# Altium project my_final_project.PrjPcb
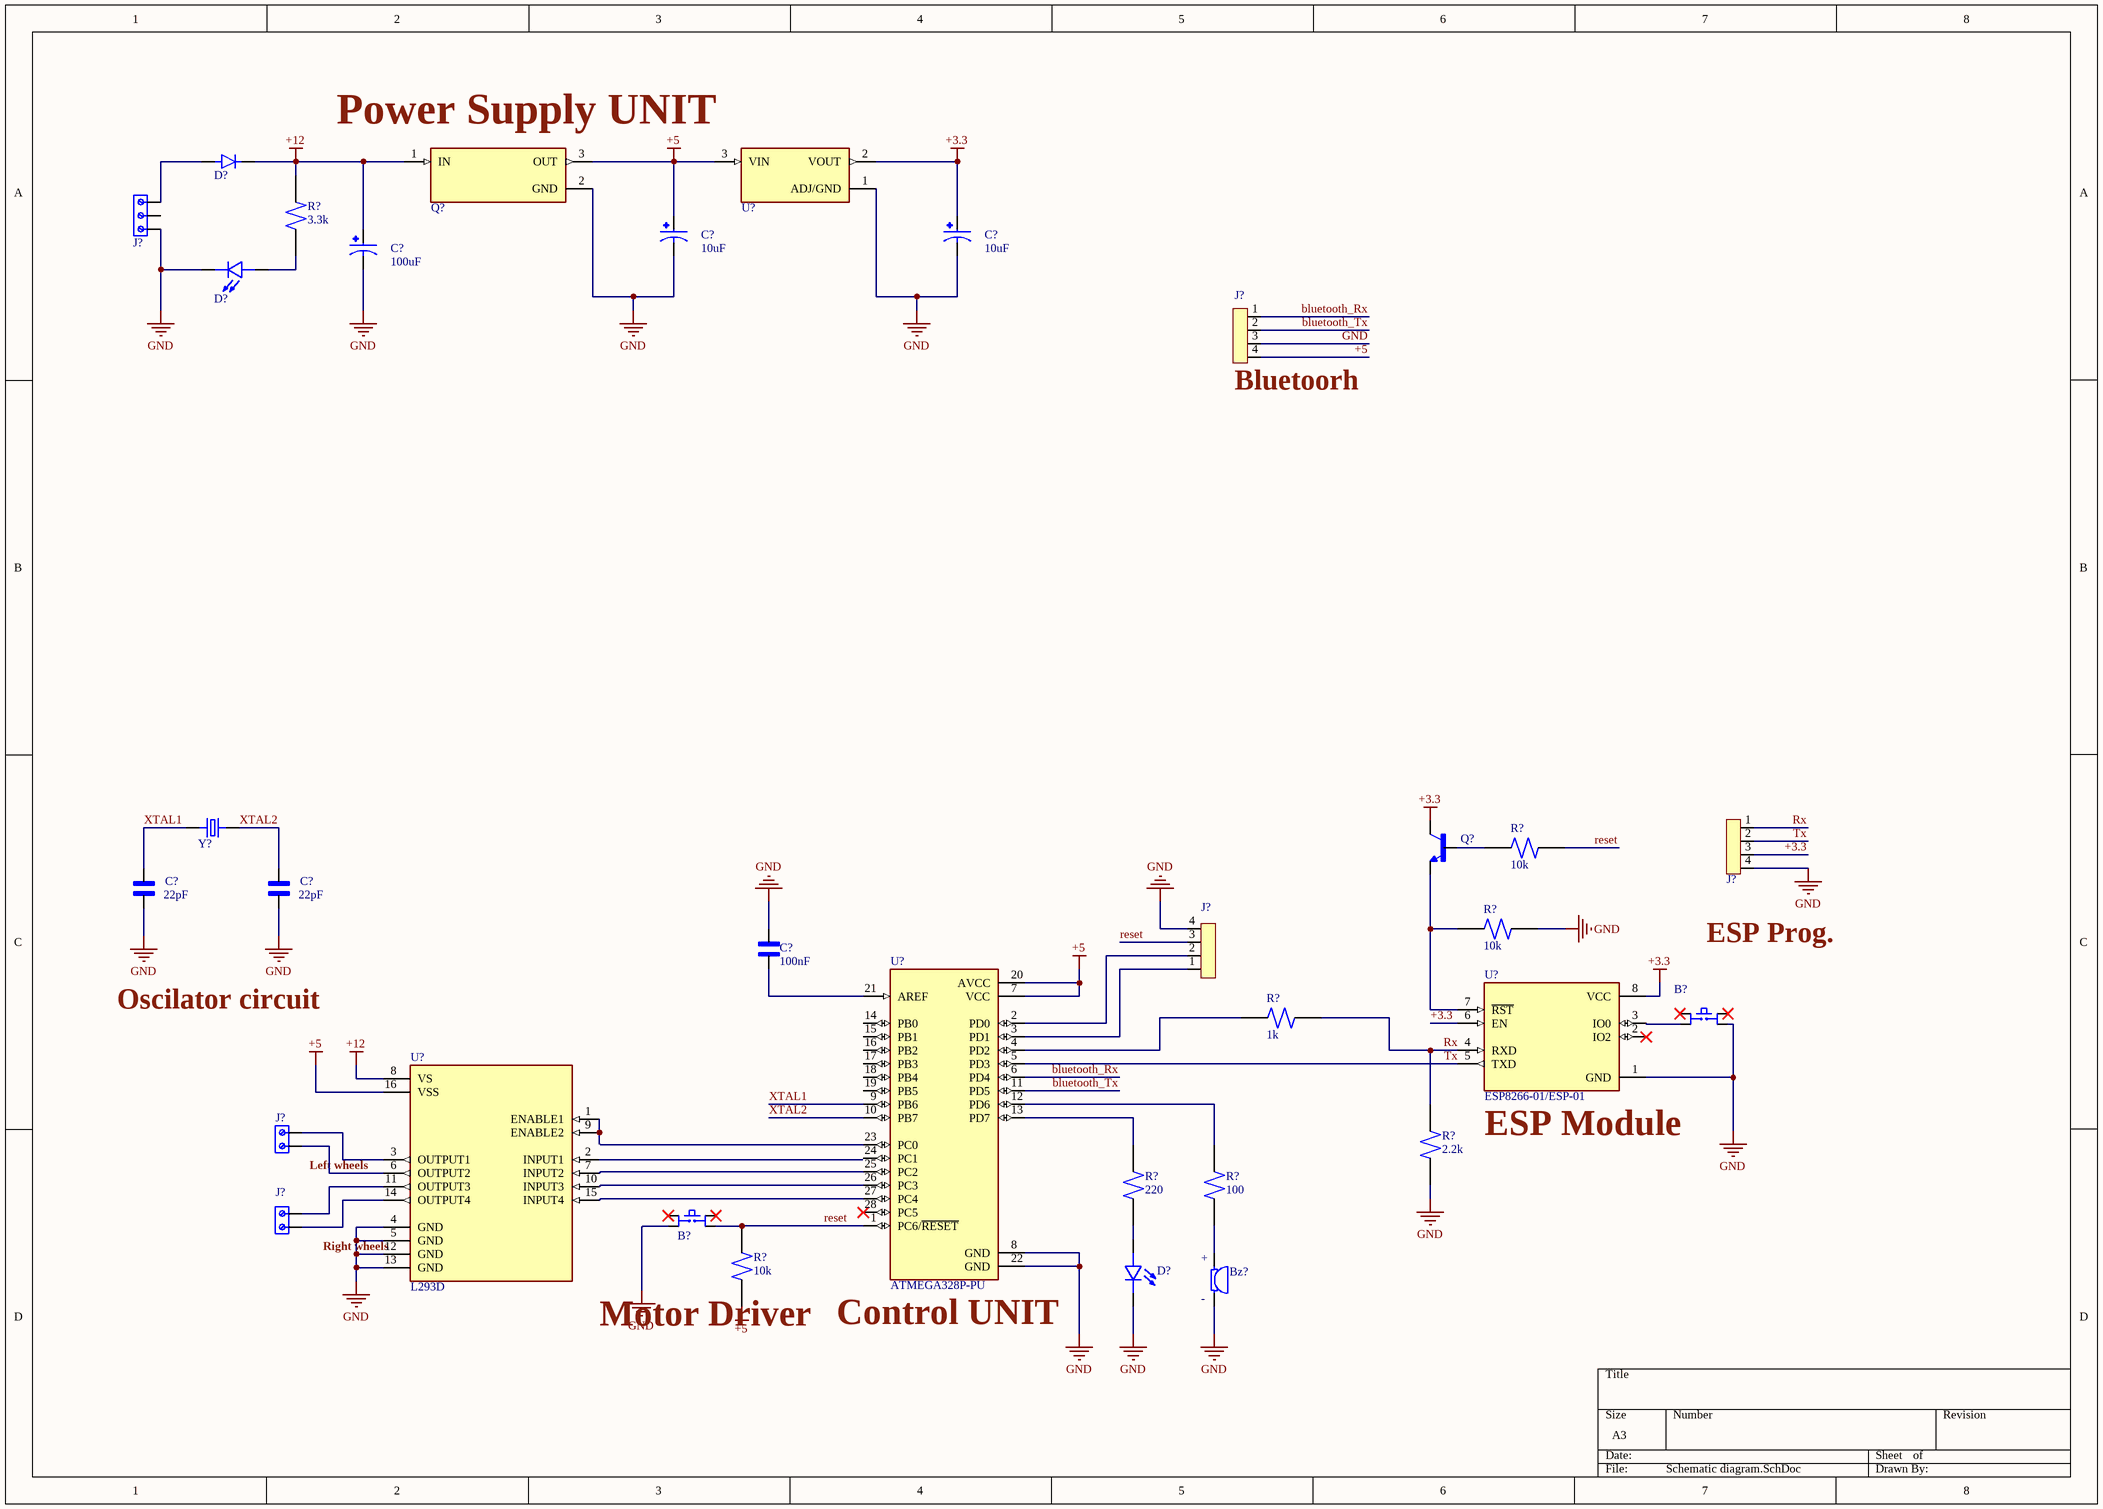
[diagram p0: Schematic diagram.SchDoc]
1 sheet, 33 parts. Net scope: global (net labels, ports and power ports of the same name join across sheets).

## Sheet Schematic diagram.SchDoc
size A3; SheetNumber: 1; SheetTotal: 1

### Parts
(Parts that share a designator on the sheet are numbered #1, #2 ... from top to bottom, then left to right.)
B?#1  Push button  [SW_TS02-66-95-BK-260-LCR-D]  (value not drawn)
B?#2  Push button  [SW_TS02-66-95-BK-260-LCR-D]  (value not drawn)
Bz?  AI-1223-TWT-12V-R  [XDCR_AI-1223-TWT-12V-R]  (value not drawn)
C?#1  10uF  [CAPPRD500W50D500H1100]
C?#2  10uF  [CAPPRD500W50D500H1100]
C?#3  100uF  [CAPPRD500W50D500H1100]
C?#4  22pF  [CAPRB500W50L450T300H550]
C?#5  22pF  [CAPRB500W50L450T300H550]
C?#6  100nF  [CAPRB500W50L450T300H550]
D?#1  1N4007  [DIOAD1060W70L435D230]  (value not drawn)
D?#2  L08R5000Q1  [LEDRD254W57D500H1070]  (value not drawn)
D?#3  L08R5000Q1  [LEDRD254W57D500H1070]  (value not drawn)
J?#1  691214110003  [691214110003]  (value not drawn)
J?#2  PPTC041LFBN-RC  [SULLINS_PPTC041LFBN-RC]  (value not drawn)
J?#3  PPTC041LFBN-RC  [SULLINS_PPTC041LFBN-RC]  (value not drawn)
J?#4  PPTC041LFBN-RC  [SULLINS_PPTC041LFBN-RC]  (value not drawn)
J?#5  691111710002  [691111710002]  (value not drawn)
J?#6  691111710002  [691111710002]  (value not drawn)
Q?#1  5V Regulator  [TO254P1054X470X1955-3]  (value not drawn)
Q?#2  BJT Transistor  [TO92250P510H770-3]  (value not drawn)
R?#1  3.3k  [RESAD1100W55L680D260]
R?#2  10k  [RESAD1100W55L680D260]
R?#3  10k  [RESAD1100W55L680D260]
R?#4  1k  [RESAD1100W55L680D260]
R?#5  2.2k  [RESAD1100W55L680D260]
R?#6  220  [RESAD1100W55L680D260]
R?#7  100  [RESAD1100W55L680D260]
R?#8  10k  [RESAD1100W55L680D260]
U?#1  3.3V Regulator  [TO255P1020X450X1968-3]  (value not drawn)
U?#2  ESP8266-01/ESP-01  [XCVR_ESP8266-01/ESP-01]
U?#3  ATMEGA328P-PU  [DIP794W46P254L2967H457Q28B]
U?#4  L293D  [DIP880W50P254L2000H510Q16]
Y?  ECS-160-S-4  [XTAL_ECS-160-20-4X]  (value not drawn)

### Nets
+3.3: C?#2.P J?#3.3 Q?#2.1(C) U?#1.2(VOUT) U?#2.6(EN) U?#2.8(VCC)
+5: C?#1.P J?#2.4 Q?#1.3(OUT) R?#8.1 U?#1.3(VIN) U?#3.7(VCC) U?#3.20(AVCC) U?#4.16(VSS)
+12: C?#3.P D?#1.C Q?#1.1(IN) R?#1.2 U?#4.8(VS)
GND: B?#1.4 B?#2.2 Bz?.N(NEG) C?#1.N C?#2.N C?#3.N C?#4.1 C?#5.1 C?#6.1 D?#2.C D?#3.C J?#1.1 J?#2.3 J?#3.4 J?#4.4 Q?#1.2(GND) R?#3.2 R?#5.1 U?#1.1(ADJ/GND) U?#2.1(GND) U?#3.8(GND) U?#3.22(GND) U?#4.4(GND) U?#4.5(GND) U?#4.12(GND) U?#4.13(GND)
bluetooth_Rx: J?#2.1 U?#3.6(PD4)
bluetooth_Tx: J?#2.2 U?#3.11(PD5)
reset: B?#2.4 J?#4.3 R?#2.2 R?#8.2 U?#3.1(PC6/~{RESET})
Rx: J?#3.1 R?#4.1 R?#5.2 U?#2.4(RXD)
Tx: J?#3.2 U?#2.5(TXD) U?#3.5(PD3)
XTAL1: C?#4.2 U?#3.9(PB6) Y?.1
XTAL2: C?#5.2 U?#3.10(PB7) Y?.2
NetB?#1_2: B?#1.2 U?#2.3(IO0)
NetBz?_P: Bz?.P(POS) R?#7.2
NetC?#6_2: C?#6.2 U?#3.21(AREF)
NetD?#1_A: D?#1.A J?#1.3
NetD?#2_A: D?#2.A R?#1.1
NetD?#3_A: D?#3.A R?#6.2
NetJ?#4_1: J?#4.1 U?#3.3(PD1)
NetJ?#4_2: J?#4.2 U?#3.2(PD0)
NetJ?#5_1: J?#5.1 U?#4.3(OUTPUT1)
NetJ?#5_2: J?#5.2 U?#4.6(OUTPUT2)
NetJ?#6_1: J?#6.1 U?#4.11(OUTPUT3)
NetJ?#6_2: J?#6.2 U?#4.14(OUTPUT4)
NetQ?#2_2: Q?#2.2(B) R?#2.1
NetQ?#2_3: Q?#2.3(E) R?#3.1 U?#2.7(~{RST})
NetR?#4_2: R?#4.2 U?#3.4(PD2)
NetR?#6_1: R?#6.1 U?#3.13(PD7)
NetR?#7_1: R?#7.1 U?#3.12(PD6)
NetU?#3_23: U?#3.23(PC0) U?#4.1(ENABLE1) U?#4.9(ENABLE2)
NetU?#3_25: U?#3.25(PC2) U?#4.7(INPUT2)
NetU?#3_26: U?#3.26(PC3) U?#4.10(INPUT3)
NetU?#3_27: U?#3.27(PC4) U?#4.15(INPUT4)

Not connected (* = marked no-connect by the designer): B?#1 1* 3*; B?#2 1* 3*; J?#1 2; U?#2 2(IO2)*; U?#3 14(PB0) 15(PB1) 16(PB2) 17(PB3) 18(PB4) 19(PB5) 24(PC1) 28(PC5)*; U?#4 2(INPUT1)

### Notes on the sheet
- Power Supply UNIT
- (near J?#2) Bluetoorh
- ESP Prog.
- Oscilator circuit
- (near J?#5) Left wheels
- (near U?#2) ESP Module
- (near J?#6) Right wheels
- (near U?#3) Control UNIT
- (near U?#4) Motor Driver
- (in symbol Buzzer) +; -

### Library data of the parts
Bz? = Buzzer: ELECTRO-MECHANICAL AUDIO INDICATOR; MF: PUI Audio,; Availability: In Stock; Package: 2225 PUI Audio; Value: *; Price: None; MP: AI-1223-TWT-12V-R; Purchase-URL: https://pricing.snapeda.com/search/part/AI-1223-TWT-12V-R/?ref=eda
C?#1-C?#3 = Electrolytic capacitor: FS-A; MF: {'manufacturer': u'Panasonic'}; MP: EEUFS0J221B; Package: None; Value: *; Availability: Unavailable; Price: None
C?#4-C?#6 = Ceramic capacitor: 2200 pF Â±10% 250V Ceramic Capacitor X7R Radial; MF: TDK; MP: FG24X7R2E222KNT06; Digi-Key_Part_Number: 445-173386-1-ND; Purchase-URL: https://pricing.snapeda.com/search/part/FG24X7R2E222KNT06/?ref=eda; Check_prices: https://www.snapeda.com/parts/FG24X7R2E222KNT06/TDK/view-part/?ref=eda; Value: *; Package: Radial TDK; SnapEDA_Link: https://www.snapeda.com/parts/FG24X7R2E222KNT06/TDK/view-part/?ref=snap
D?#1 = Diode: Diode Switching 1KV 1A 2-Pin DO-41; Price: None; MP: 1N4007; Value: *; Availability: Unavailable; Package: None
D?#2 D?#3 = LED: LED, Orange, Through Hole, T-1 3/4 (5mm), 30 mA, 2.1 V, 635 nm; MF: {'manufacturer': u'LED Technology'}; Price: None; Package: None; Availability: Unavailable; MP: L08R5000Q1; Value: *
J?#1 = Terminal blocks - 3Pins (Small): 3 Position Wire to Board Terminal Block Horizontal with Board 0.138 (3.50mm) Through Hole; MF: Wurth Elektronik; Price: None; SnapEDA_Link: https://www.snapeda.com/parts/691214110003/Wurth+Elektronik/view-part/?ref=snap; Purchase-URL: https://pricing.snapeda.com/search/part/691214110003/?ref=eda; Availability: In Stock; MP: 691214110003; Package: None; Check_prices: https://www.snapeda.com/parts/691214110003/Wurth+Elektronik/view-part/?ref=eda; Value: *
J?#2-J?#4 = Female header - 4Pins: 4 Position Header Connector Through Hole; MF: Sullins Connector; MP: PPTC041LFBN-RC; Value: *; SnapEDA_Link: https://www.snapeda.com/parts/PPTC041LFBN-RC/Sullins%20Connector%20Solutions/view-part/285917/?ref=snap; Package: None; Availability: Warning; Check_prices: https://www.snapeda.com/parts/PPTC041LFBN-RC/Sullins%20Connector%20Solutions/view-part/285917/?ref=eda; Price: None; Purchase-URL: https://pricing.snapeda.com/search/part/PPTC041LFBN-RC/?ref=eda
J?#5 J?#6 = Terminal Block - 2Pins: 2 Position Wire to Board Terminal Block Horizontal with Board 0.197 _5.00mm_ Through Hole; MF: Wurth Electronics; Value: *; Availability: Unavailable; MP: 691111710002; Price: None; Package: None; SnapEDA_Link: https://www.snapeda.com/parts/691111710002/Wurth%20Electronics%20Inc./view-part/1195092/?ref=snap
Q?#1 = LM7805: MP: LM7805CT/NOPB; Price: None; Value: *; Availability: Unavailable; Package: None
Q?#2 = BC547B: <a href="https://pricing.snapeda.com/parts/BC337-16%20A1/Taiwan%20Semiconductor/view-part?ref=eda">Check availability</a> <a href="https://pricing.snapeda.com/parts/BC337-16%20A1/Taiwan%20Semiconductor/view-part?ref=eda">Check availability</a>; Price: None; Value: *; Package: None; Availability: Unavailable; MP: BC547B
R?#1-R?#8 = Resistor (0.25W): (MFR-25FBF52-10K) 10,2 kOhm bei 1% 0,25W, 1/4W Durchbohrlochwiderstand Axial Metal Film; MF: Yageo; Digi-Key_Part_Number: 10.2KXBK-ND; SnapEDA_Link: https://www.snapeda.com/parts/MFR-25FBF52-10K/Yageo/view-part/424333/?ref=snap; Package: Axial Yageo; Purchase-URL: https://pricing.snapeda.com/search/part/MFR-25FBF52-10K/?ref=eda; MP: MFR-25FBF52-10K; Value: *
U?#1 = LD1117V33: Package: None; MP: LD1117V33; Price: None; Availability: Unavailable; Value: *
U?#2 = ESP8266-01 Module: MakerFocus 4pcs ESP8266 ESP-01 Serial Wireless WiFi Transceiver Receiver Module 1MB SPI Flash DC3.0-3.6V Internet of Things WiFi Module Board Compatible with Ar duino; Value: *; MP: ESP8266-01/ESP-01; Package: None; Availability: Unavailable; Price: None
U?#3 = ATMEGA328P-PU: ATmega Series 20 MHz 32 KB Flash 2 KB SRAM 8-Bit Microcontroller - DIP-28; Value: *; MP: ATMEGA328P-PU; Package: None; Availability: Unavailable; Price: None
U?#4 = L293D: 4-Channel Motor Driver 24V 16-Pin Power PDIP Tube; Price: None; Package: None; Availability: Unavailable; MP: L293D; Value: *
Y? = Crystal oscilator: CRYSTAL T/H; MF: {'manufacturer': u'ECS Inc.'}; Package: None; Value: *; MP: ECS-160-S-4; Availability: Unavailable; Price: None